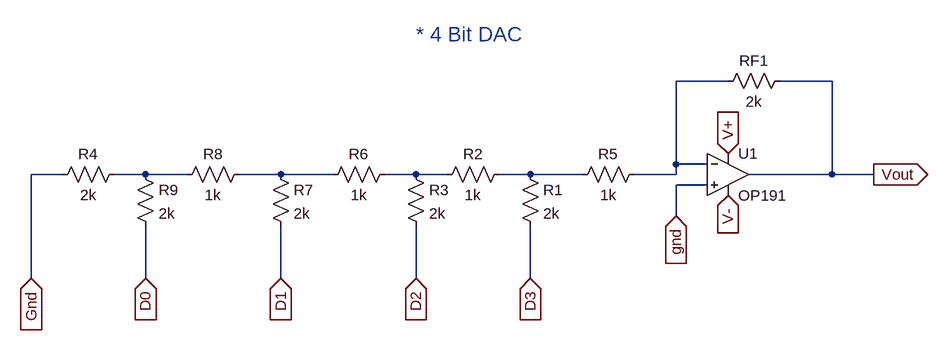
[diagram p0: schematic 4bitDAC.asc]
4bitDAC.asc, the LTspice schematic file:
Version 4
SHEET 1 880 680
WIRE 496 -32 416 -32
WIRE 656 -32 576 -32
WIRE 416 96 416 -32
WIRE 464 96 416 96
WIRE -528 112 -576 112
WIRE -400 112 -448 112
WIRE -336 112 -400 112
WIRE -192 112 -256 112
WIRE -112 112 -192 112
WIRE 16 112 -32 112
WIRE 64 112 16 112
WIRE 192 112 144 112
WIRE 272 112 192 112
WIRE 416 112 416 96
WIRE 416 112 352 112
WIRE 656 112 656 -32
WIRE 656 112 528 112
WIRE 720 112 656 112
WIRE 464 128 416 128
WIRE 416 176 416 128
WIRE -576 272 -576 112
WIRE -400 272 -400 192
WIRE -192 272 -192 192
WIRE 16 272 16 192
WIRE 192 272 192 192
FLAG 496 80 V+
IOPIN 496 80 In
FLAG 496 144 V-
IOPIN 496 144 In
FLAG 720 112 Vout
IOPIN 720 112 Out
FLAG -400 272 D0
IOPIN -400 272 In
FLAG -192 272 D1
IOPIN -192 272 In
FLAG -576 272 Gnd
IOPIN -576 272 In
FLAG 416 176 gnd
IOPIN 416 176 In
FLAG 16 272 D2
IOPIN 16 272 In
FLAG 192 272 D3
IOPIN 192 272 In
SYMBOL res 176 96 R0
SYMATTR InstName R1
SYMATTR Value 2k
SYMATTR SpiceLine tol=5kohms
SYMBOL res 160 96 R90
WINDOW 0 0 56 VBottom 2
WINDOW 3 32 56 VTop 2
SYMATTR InstName R2
SYMATTR Value 1k
SYMATTR SpiceLine tol=5kohms
SYMBOL res 0 96 R0
SYMATTR InstName R3
SYMATTR Value 2k
SYMATTR SpiceLine tol=5kohms
SYMBOL res -432 96 R90
WINDOW 0 0 56 VBottom 2
WINDOW 3 32 56 VTop 2
SYMATTR InstName R4
SYMATTR Value 2k
SYMBOL res 592 -48 R90
WINDOW 0 0 56 VBottom 2
WINDOW 3 32 56 VTop 2
SYMATTR InstName RF1
SYMATTR Value 2k
SYMBOL OpAmps\\OP191 496 48 R0
SYMATTR InstName U1
SYMBOL res 368 96 R90
WINDOW 0 0 56 VBottom 2
WINDOW 3 32 56 VTop 2
SYMATTR InstName R5
SYMATTR Value 1k
SYMBOL res -16 96 R90
WINDOW 0 0 56 VBottom 2
WINDOW 3 32 56 VTop 2
SYMATTR InstName R6
SYMATTR Value 1k
SYMBOL res -208 96 R0
SYMATTR InstName R7
SYMATTR Value 2k
SYMBOL res -240 96 R90
WINDOW 0 0 56 VBottom 2
WINDOW 3 32 56 VTop 2
SYMATTR InstName R8
SYMATTR Value 1k
SYMBOL res -416 96 R0
SYMATTR InstName R9
SYMATTR Value 2k
TEXT 16 -104 Left 3 ;* 4 Bit DAC

The netlist it stands for:
* 4bitDAC.asc
R1 N005 D3 2k tol=5kohms
R2 N005 N004 1k tol=5kohms
R3 N004 D2 2k tol=5kohms
R4 N002 Gnd 2k
RF1 Vout N001 2k
XU1 Gnd N001 V+ V- Vout OP191  ; pins In+ In- V+ V- OUT
R5 N001 N005 1k
R6 N004 N003 1k
R7 N003 D1 2k
R8 N003 N002 1k
R9 N002 D0 2k
* * 4 Bit DAC
.lib ADI.lib
.backanno
.end